# Altium schematic sheet DSI_LCD.SchDoc: MIPI connector for DSI LCD and HDMI boards.
size A4; Date: 29-OCT-2015; Author: A.B; CompanyName: STMicroelectronics; Organization: MCD/TOOLS/GNB; Address1: 12, Rue Jules HOROWITZ; Address2: 38019 Grenoble; Address3: FRANCE; DocumentNumber: MB1225; Revision: B-01; SheetNumber: 11; SheetTotal: 12; Project: STM32F769I-DISCO
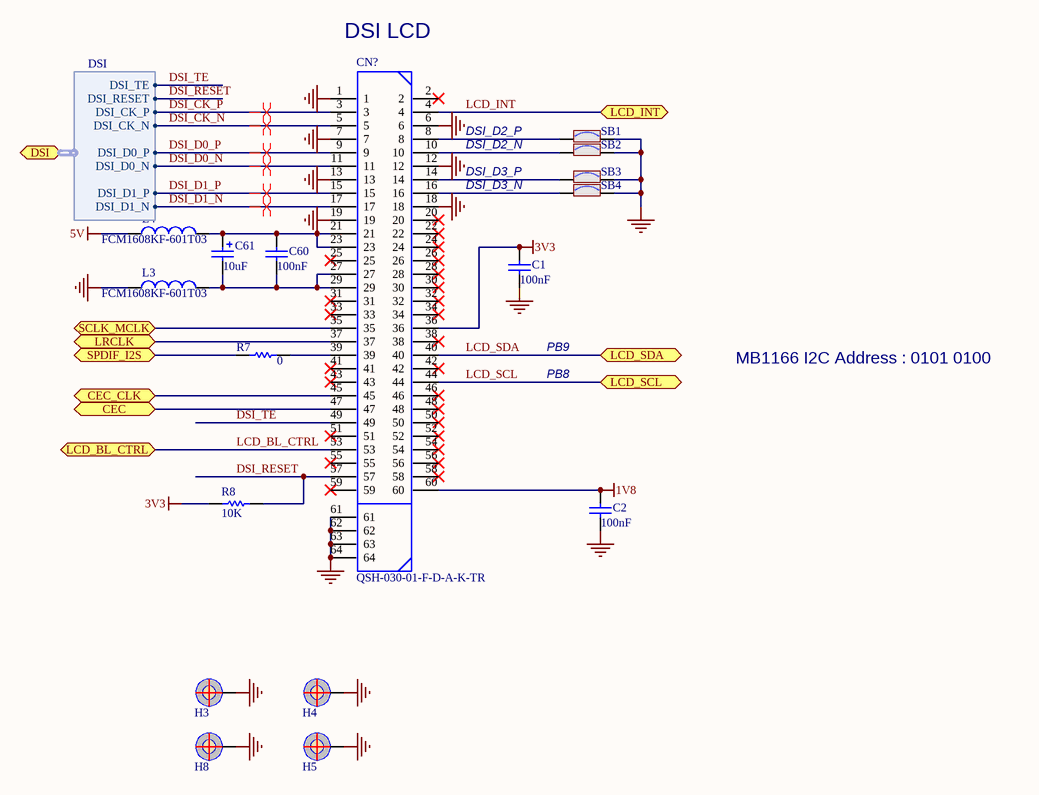
[diagram p0: DSI_LCD.SchDoc]

## Parts
C1  100nF  [0603C]
C2  100nF  [0603C]
C60  100nF  [0603C]
C61  10uF  [TAN-A]
CN?  QSH-030-01-F-D-A-K-TR  [QSH-030-01-F-D-A]
H3  POSITION HOLE  [HOLE_C9D4R5]  (value not drawn)
H4  POSITION HOLE  [HOLE_C9D4R5]  (value not drawn)
H5  POSITION HOLE  [HOLE_C9D4R5]  (value not drawn)
H8  POSITION HOLE  [HOLE_C9D4R5]  (value not drawn)
L3  FCM1608KF-601T03  [0603L]
L4  FCM1608KF-601T03  [0603L]
R7  0  [0402R]
R8  10K  [0402R]
SB1  Solder Bridge ON  [JP2_SMD]  (value not drawn)
SB2  Solder Bridge ON  [JP2_SMD]  (value not drawn)
SB3  Solder Bridge ON  [JP2_SMD]  (value not drawn)
SB4  Solder Bridge ON  [JP2_SMD]  (value not drawn)

## Ports
CEC, CEC_CLK, DSI (harness DSI), LCD_BL_CTRL, LCD_INT, LCD_SCL, LCD_SDA, LRCLK, SCLK_MCLK, SPDIF_I2S

## Harnesses
DSI: DSI_CK_P, DSI_CK_N, DSI_D0_P, DSI_D0_N, DSI_D1_P, DSI_D1_N, DSI_TE, DSI_RESET

## Nets
1V8: C2.2 CN?.60
3V3: C1.2 CN?.36 R8.1
5V: L4.1
GND: C1.1 C2.1 CN?.1 CN?.6 CN?.7 CN?.12 CN?.13 CN?.18 CN?.19 CN?.61 CN?.62 CN?.63 CN?.64 H3.1 H4.1 H5.1 H8.1 L3.1 SB1.2 SB2.2 SB3.2 SB4.2
CEC: CN?.47 ; port CEC
CEC_CLK: CN?.45 ; port CEC_CLK
DSI_CK_N: CN?.5 ; port DSI.DSI_CK_N
DSI_CK_P: CN?.3 ; port DSI.DSI_CK_P
DSI_D0_N: CN?.11 ; port DSI.DSI_D0_N
DSI_D0_P: CN?.9 ; port DSI.DSI_D0_P
DSI_D1_N: CN?.17 ; port DSI.DSI_D1_N
DSI_D1_P: CN?.15 ; port DSI.DSI_D1_P
DSI_RESET: CN?.57 R8.2 ; port DSI.DSI_RESET
DSI_TE: CN?.49 ; port DSI.DSI_TE
LCD_BL_CTRL: CN?.53 ; port LCD_BL_CTRL
LCD_INT: CN?.4 ; port LCD_INT
LCD_SCL: CN?.44 ; port LCD_SCL
LCD_SDA: CN?.40 ; port LCD_SDA
LRCLK: CN?.37 ; port LRCLK
SCLK_MCLK: CN?.35 ; port SCLK_MCLK
SPDIF_I2S: R7.1 ; port SPDIF_I2S
NetC60_1: C60.1 C61.2 CN?.27 CN?.29 L3.2
NetC60_2: C60.2 C61.1 CN?.21 CN?.23 L4.2
NetCN?_8: CN?.8 SB1.1
NetCN?_10: CN?.10 SB2.1
NetCN?_14: CN?.14 SB3.1
NetCN?_16: CN?.16 SB4.1
NetCN?_39: CN?.39 R7.2

Not connected (* = marked no-connect by the designer): CN? 2* 20* 22* 24* 25* 26* 28* 30* 31* 32* 33* 34* 38* 41* 42* 43* 46* 48* 50* 51* 52* 54* 55* 56* 58* 59*

## Layout directives
differential pair: DSI_CK_N, DSI_CK_P, DSI_D0_N, DSI_D0_P, DSI_D1_N, DSI_D1_P

## Notes on the sheet
- DSI LCD
- DSI_D2_P
- DSI_D2_N
- DSI_D3_P
- DSI_D3_N
- PB9
- PB8
- MB1166 I2C Address : 0101 0100
- Title:
- Project:
- Size:
- Date:
- A4
- Reference:
- Sheet:
- Revision:
- of

## Library data of the parts
C1 C2 C60 = Cap_100nF_X7R_10%_0603: Capacitor,100nF,16V,X7R,10%,0603,YAGEO; Manuf_Part_1: CC0603KRX7R9BB104; Revision: July-2002: Re-released for DXP Platform.; Value: 100nF; Order: CC0603KRX7R9BB104; Manuf_1: YAGEO; ECCN_US/EU: n/a
C61 = Cap_10uF_POL_10%_TANA: Polarized Capacitor,10uF,10V,10%,typeA,VISHAY; Manuf_Part_1: 293D106X9010A2TE3; Revision: July-2002: Re-released for DXP Platform.; Value: 10uF; Manuf_1: VISHAY; Order: *; ECCN_US/EU: n/a
CN? = QSH-030-01-F-D-A: HIGH SPEED SOCKET STRIP, .5mm PITCH, 60 PINS; Manuf_1: SAMTEC; Provided: Sub Co; Ref St: 9183715; Manuf_Part_1: QSH-030-01-F-D-A-K-TR; ECCN_US/EU: n/a
L3 L4 = BEAD_600R_350MA_0603: Bead,600R,350mA,0603,FCM1608KF-601T03,Tai-tech; Manuf_2: TDK; Manuf_Part_2: MPZ1608S300A; Manuf_Part_3: BLM18PG121SN1D; Manuf_3: MURATA; Value: 100uH; Description_2: Bead,30R,5A,0603,MPZ1608S300A,TDK; Description_3: Bead,120R,2A,0603,BLM18PG121SN1D,MURATA; Revision: July-2002: Re-released for DXP Platform.; Manuf_Part_1: FCM1608KF-601T03; Manuf_1: Tai-tech; ECCN_US/EU: n/a
R7 = Res_0_5%_0402: Resistor,0,0402,5%,YAGEO; Manuf_Part_1: RC0402JR-070RL; Order: 2363467; Value: 0; ECCN_US/EU: n/a; Manuf_1: YAGEO; Distrib: FARNELL
R8 = Res_10K_1%_0402: Resistor,10K,0402,1%,YAGEO; Manuf_Part_1: RC0402FR-0710KL; Value: 10K; Manuf_1: YAGEO; Order: RC0402FR-0710KL; ECCN_US/EU: n/a
SB1-SB4 = SB_ON: Solder: YES; Revision: July-2002: Re-released for DXP Platform.; ECCN_US/EU: n/a